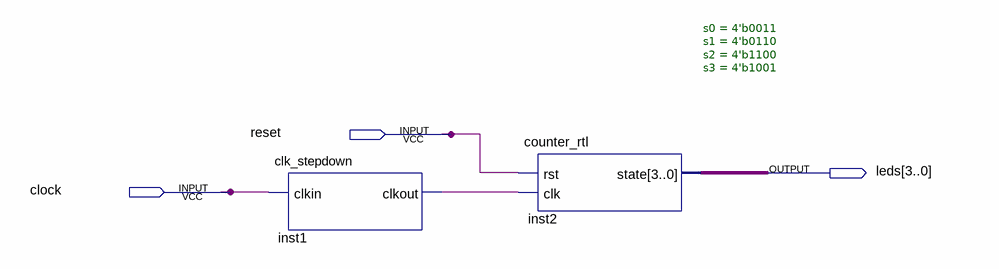
[diagram p0: schematic sheet]
// Quartus schematic counter.bdf as structural Verilog: 2 symbols, 3 pins
module counter (
  input  reset,
  input  clock,
  output [3:0] leds
);

  wire inst1_clkout;

  clk_stepdown inst1 (.clkin(clock), .clkout(inst1_clkout));
  counter_rtl #(.s0(4'b0011), .s1(4'b0110), .s2(4'b1100), .s3(4'b1001)) inst2 (
    .rst(reset), .clk(inst1_clkout), .state(leds));
endmodule
